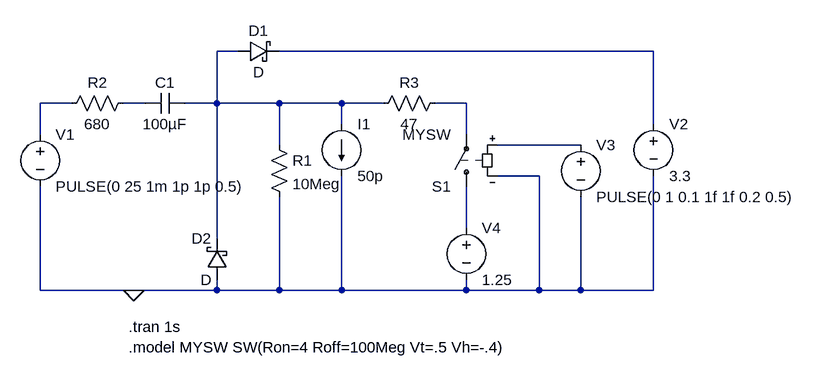
[diagram p0: schematic input.asc]
input.asc, the LTspice schematic file:
Version 4
SHEET 1 1020 688
WIRE 144 176 112 176
WIRE 784 176 208 176
WIRE -112 256 -160 256
WIRE 0 256 -32 256
WIRE 112 256 112 176
WIRE 112 256 64 256
WIRE 208 256 112 256
WIRE 304 256 208 256
WIRE 368 256 304 256
WIRE 496 256 448 256
WIRE 304 288 304 256
WIRE 784 288 784 176
WIRE -160 304 -160 256
WIRE 496 304 496 256
WIRE 208 320 208 256
WIRE 672 320 544 320
WIRE 608 368 544 368
WIRE 496 448 496 384
WIRE 112 464 112 256
WIRE -160 544 -160 384
WIRE -16 544 -160 544
WIRE 112 544 112 528
WIRE 112 544 -16 544
WIRE 208 544 208 400
WIRE 208 544 112 544
WIRE 304 544 304 368
WIRE 304 544 208 544
WIRE 496 544 496 528
WIRE 496 544 304 544
WIRE 608 544 608 368
WIRE 608 544 496 544
WIRE 672 544 672 400
WIRE 672 544 608 544
WIRE 784 544 784 368
WIRE 784 544 672 544
FLAG -16 544 0
SYMBOL voltage -160 288 R0
SYMATTR InstName V1
SYMATTR Value PULSE(0 25 1m 1p 1p 0.5)
SYMBOL cap 64 240 R90
WINDOW 0 0 32 VBottom 2
WINDOW 3 32 32 VTop 2
SYMATTR InstName C1
SYMATTR Value 100µF
SYMBOL res 192 304 R0
SYMATTR InstName R1
SYMATTR Value 10Meg
SYMBOL current 304 288 R0
SYMATTR InstName I1
SYMATTR Value 50p
SYMBOL res -16 240 R90
WINDOW 0 0 56 VBottom 2
WINDOW 3 32 56 VTop 2
SYMATTR InstName R2
SYMATTR Value 680
SYMBOL schottky 144 192 R270
WINDOW 0 32 32 VTop 2
WINDOW 3 0 32 VBottom 2
SYMATTR InstName D1
SYMBOL voltage 784 272 R0
SYMATTR InstName V2
SYMATTR Value 3.3
SYMBOL sw 496 400 R180
SYMATTR InstName S1
SYMATTR Value MYSW
SYMBOL res 464 240 R90
WINDOW 0 0 56 VBottom 2
WINDOW 3 32 56 VTop 2
SYMATTR InstName R3
SYMATTR Value 47
SYMBOL voltage 672 304 R0
SYMATTR InstName V3
SYMATTR Value PULSE(0 1 0.1 1f 1f 0.2 0.5)
SYMBOL voltage 496 432 R0
SYMATTR InstName V4
SYMATTR Value 1.25
SYMBOL schottky 128 528 R180
WINDOW 0 24 64 Left 2
WINDOW 3 24 0 Left 2
SYMATTR InstName D2
TEXT -24 600 Left 2 !.tran 1s
TEXT -24 632 Left 2 !.model MYSW SW(Ron=4 Roff=100Meg Vt=.5 Vh=-.4)

The netlist it stands for:
* input.asc
V1 N003 0 PULSE(0 25 1m 1p 1p 0.5)
C1 N001 N004 100µF
R1 N001 0 10Meg
I1 N001 0 50p
R2 N004 N003 680
D1 N001 N002 D
V2 N002 0 3.3
S1 N007 N005 N006 0 MYSW
R3 N005 N001 47
V3 N006 0 PULSE(0 1 0.1 1f 1f 0.2 0.5)
V4 N007 0 1.25
D2 0 N001 D
.model D D
.lib standard.dio
.tran 1s
.model MYSW SW(Ron=4 Roff=100Meg Vt=.5 Vh=-.4)
.backanno
.end